# Altium schematic sheet Microcontroller Support.SchDoc: Microcontroller Support
size 228 x 165 mm; DrawnBy: Joseph Riesen; DocumentNumber: 3; Revision: 1.0; SheetNumber: 3; SheetTotal: 10
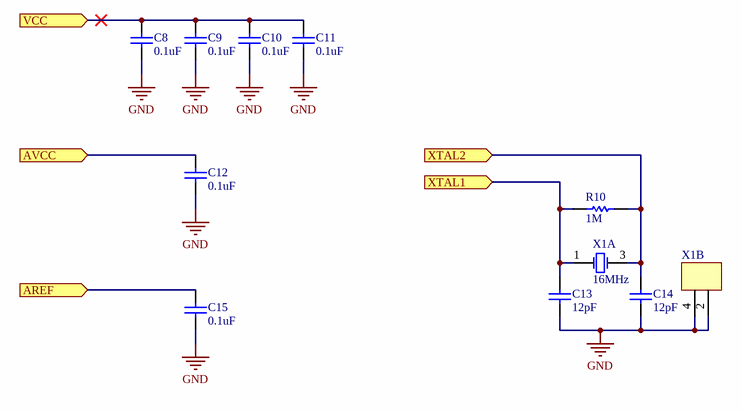
[diagram p0: Microcontroller Support.SchDoc]

## Parts
C8  0.1uF  [CAPC0805(2012)100_M]
C9  0.1uF  [CAPC0805(2012)100_M]
C10  0.1uF  [CAPC0805(2012)100_M]
C11  0.1uF  [CAPC0805(2012)100_M]
C12  0.1uF  [CAPC0805(2012)100_M]
C13  12pF  [CAPC1608X87X35ML15T15]
C14  12pF  [CAPC1608X87X35ML15T15]
C15  0.1uF  [CAPC0805(2012)100_M]
R10  1M  [RESC2013X70X40NL20T20]
X1  16MHz  [DFN220P320X80-4M]  (parts A,B of 2)

## Ports
AREF (in), AVCC (in), VCC (in), XTAL1 (in), XTAL2 (in)

## Nets
GND: C8.1 C9.1 C10.1 C11.1 C12.1 C13.1 C14.1 C15.1 X1.2(GND) X1.4(GND)
AREF: C15.2 ; port AREF
AVCC: C12.2 ; port AVCC
VCC: C8.2 C9.2 C10.2 C11.2 ; port VCC
XTAL1: C13.2 R10.2 X1.1(X1) ; port XTAL1
XTAL2: C14.2 R10.1 X1.3(X2) ; port XTAL2

## Notes on the sheet
- Title:
- Size:
- Letter
- Drawn By:
- Rev:
- Date:
- Time:
- Sheet
- /

## Library data of the parts
C8-C12 C15 = CMP-1036-04391-1: CAP 100nF 6.3V ±10% 0805 (2012 Metric) Thickness 1mm SMD; Case-EIA: 0805; Case-Metric: 2012; Tolerance: Â±10%; Rated Voltage: 6.3 V; Technology: SMT; Value: 100nF; Max Thickness: 1 mm; ClassName: =ComponentClassName
C13 C14 = CMP-2006-03475-1: Manufacturer: Kemet; Part Number: C0603C120C5GACTU; ClassName: =ComponentClassName
R10 = CMP-1665-00012-4: Chip Resistor, 1000 KOhm, +/- 1%, 0.125 W, -55 to 155 degC, 0805 (2012 Metric), RoHS, Tape and Reel; Manufacturer: Panasonic; Voltage Rating: 150 V; ComponentLink2URL: http://industrial.panasonic.com/cdbs/www-data/pdf/RDA0000/AOA0000C86.pdf; PackageReference: 0805; Min Operating Temperature: -55 degC; RoHSCompliant: true; Package Quantity: 5000; ComponentLink1URL: http://www.panasonic.com/; Pins: 2; Height: 0.6 mm; Packaging: Tape and Reel; ComponentLink2Description: Datasheet; ComponentLink1Description: Manufacturer URL; Mounting Technology: Surface Mount; REACH SVHC: Yes; Mount: Surface Mount; PackageDescription: 2-Pin Surface Mount Device, Body 2 x 1.25 mm; DatasheetVersion: 04/2015; Max Operating Temperature: 155 degC; Length: 2 mm; ClassName: =ComponentClassName
X1 = FC3BACAGI16.0-T3: CRYSTAL16MHZ 12PF SMD; Manufacturer: Fox Electronics; Supplier 1: Digi-Key; Manufacturer Part Number: FC3BACAGI16.0-T3; Stock 1: 2804; Pricing 1: 1 = 0.510000, 10 = 0.422000, 50 = 0.379400, 100 = 0.337300, 500 = 0.320400, 1000 = 0.269810 (USD); RoHS 1: No; Supplier Part Number 1: 631-1490-1-ND; ComponentLink1Description: Datasheet; ComponentLink1URL: http://www.foxonline.com/pdfs/C3BA.pdf; ClassName: =ComponentClassName